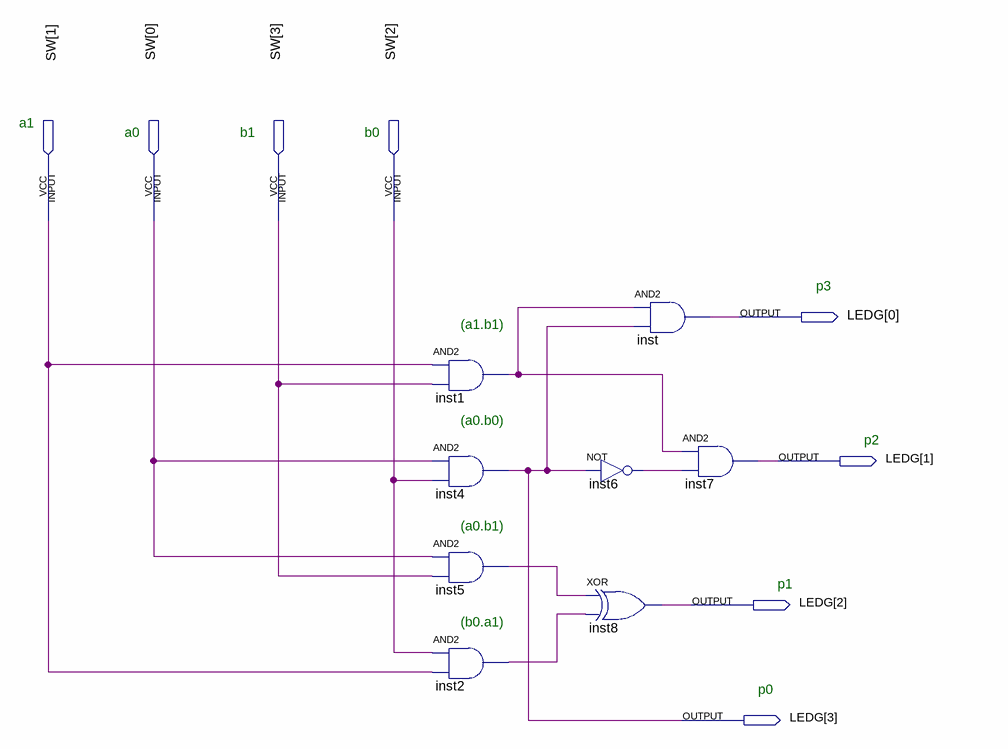
[diagram p0: schematic sheet]
// Quartus schematic BME_393L__lab_2__5_2.bdf as structural Verilog: 8 symbols, 8 pins
module BME_393L__lab_2__5_2 (
  input  [3:0] SW,
  output [3:0] LEDG
);

  wire inst1_out, inst2_out, inst5_out, inst6_out;

  and inst1 (inst1_out, SW[1], SW[3]);
  and inst4 (LEDG[3], SW[0], SW[2]);
  and inst5 (inst5_out, SW[0], SW[3]);
  and inst2 (inst2_out, SW[2], SW[1]);
  and inst (LEDG[0], inst1_out, LEDG[3]);
  not inst6 (inst6_out, LEDG[3]);
  xor inst8 (LEDG[2], inst5_out, inst2_out);
  and inst7 (LEDG[1], inst1_out, inst6_out);

  // Notes on the sheet:
  //   a1
  //   a0
  //   b1
  //   b0
  //   p3
  //   (a1.b1)
  //   (a0.b0)
  //   p2
  //   (a0.b1)
  //   p1
  //   (b0.a1)
  //   p0
endmodule
